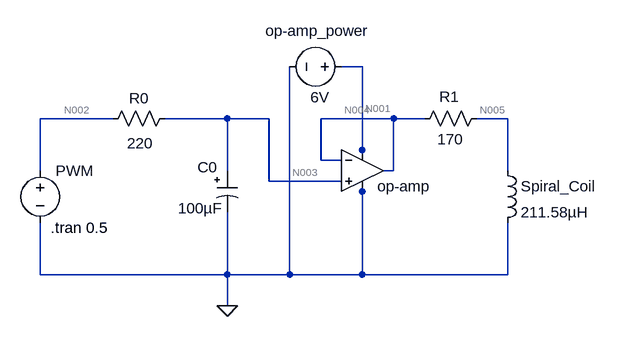
[diagram p0: schematic OpAmp.asc]
OpAmp.asc, the LTspice schematic file:
Version 4
SHEET 1 948 680
WIRE 128 -864 96 -864
WIRE -256 -784 -368 -784
WIRE -80 -784 -176 -784
WIRE -16 -784 -80 -784
WIRE 176 -784 64 -784
WIRE 224 -784 176 -784
WIRE 352 -784 304 -784
WIRE 128 -736 128 -864
WIRE 64 -720 64 -784
WIRE 96 -720 64 -720
WIRE 128 -720 128 -736
WIRE -368 -704 -368 -784
WIRE -80 -704 -80 -784
WIRE 176 -704 176 -784
WIRE 176 -704 160 -704
WIRE 352 -704 352 -784
WIRE -16 -688 -16 -784
WIRE 96 -688 -16 -688
WIRE 128 -672 128 -688
WIRE -368 -544 -368 -624
WIRE -80 -544 -80 -640
WIRE -80 -544 -368 -544
WIRE 16 -544 16 -864
WIRE 16 -544 -80 -544
WIRE 128 -544 128 -672
WIRE 128 -544 16 -544
WIRE 352 -544 352 -624
WIRE 352 -544 128 -544
WIRE -80 -496 -80 -544
FLAG -80 -496 0
SYMBOL voltage -368 -720 R0
WINDOW 3 24 96 Invisible 2
WINDOW 123 0 0 Left 0
WINDOW 39 0 0 Left 0
SYMATTR Value PULSE(0 5 0 0 0 0.0006 0.00066 1000)
SYMATTR InstName PWM
SYMBOL res -160 -800 R90
WINDOW 0 0 56 VBottom 2
WINDOW 3 38 54 VTop 2
SYMATTR InstName R0
SYMATTR Value 220
SYMBOL polcap -96 -704 R0
WINDOW 0 -30 -5 Left 2
WINDOW 3 -60 58 Left 2
SYMATTR InstName C0
SYMATTR Value 100µF
SYMATTR SpiceLine V=10 Irms=1.9 Rser=0.04 Lser=0 mfg="SANYO" pn="10TPC100M" type="Tantalum"
SYMATTR Description Capacitor
SYMATTR Type cap
SYMBOL ind 336 -720 R0
SYMATTR InstName Spiral_Coil
SYMATTR Value 211.58µH
SYMATTR SpiceLine Rser=14.14
SYMBOL OpAmps\\UniversalOpAmp 128 -704 R0
WINDOW 0 23 24 Left 2
SYMATTR InstName op-amp
SYMBOL voltage 112 -864 R90
WINDOW 123 0 0 Left 0
WINDOW 39 0 0 Left 0
WINDOW 0 -55 -29 VRight 2
WINDOW 3 47 35 VRight 2
SYMATTR InstName op-amp_power
SYMATTR Value 6V
SYMBOL res 320 -800 R90
WINDOW 0 -2 58 VBottom 2
WINDOW 3 32 56 VTop 2
SYMATTR InstName R1
SYMATTR Value 170
TEXT -352 -616 Left 2 !.tran 0.5

The netlist it stands for:
* OpAmp.asc
V§PWM N002 0 PULSE(0 5 0 0 0 0.0006 0.00066 1000)
R0 N003 N002 220
C0 N003 0 100µF V=10 Irms=1.9 Rser=0.04 Lser=0 mfg="SANYO" pn="10TPC100M" type="Tantalum"
L§Spiral_Coil N005 0 211.58µH Rser=14.14
Xop-amp N003 N004 N001 0 N004 level1 Avol=1Meg GBW=10Meg Vos=0 En=0 Enk=0 In=0 Ink=0 Rin=500Meg  ; pins In+ In- V+ V- OUT
V§op-amp_power N001 0 6V
R1 N005 N004 170
.tran 0.5
.lib UniversalOpAmp1.lib
.backanno
.end

* Results of the author's LTspice run, read from the files saved beside the schematic
* Operating Point, zero values left out:
*   V(n003) = 1.32 µV
*   V(n005) = 101.4 nV
*   V(n004) = 1.32 µV
*   V(n001) = 6 V
*   I(Spiral_coil) = 7.168 nA
*   I(R0) = 6 nA
*   I(R1) = -7.168 nA
*   I(Pwm) = 6 nA
*   I(Op-amp_power) = -12 nA
*   Ix(op-amp:1) = -6 nA
*   Ix(op-amp:2) = -6 nA
*   Ix(op-amp:3) = 12 nA
*   Ix(op-amp:5) = -2.448 nA
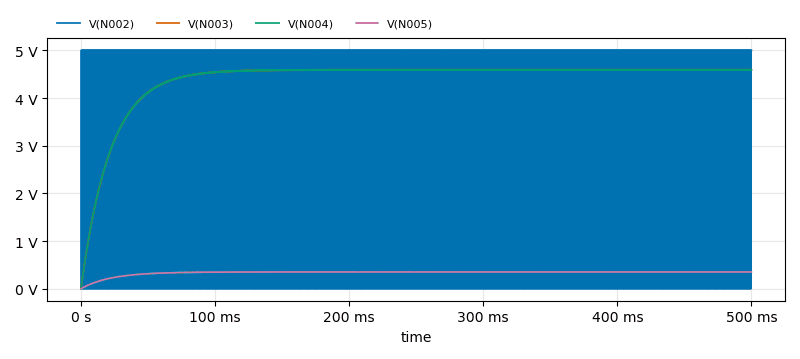
[diagram p1: Transient Analysis of OpAmp.asc, plotted from the saved traces]
* Transient Analysis, 1 run:
*   V(N002): min 0 V, max 5 V, average 4.591 V, rms 4.791 V, last 5 V
*   V(N003): min 1.32 µV, max 4.597 V, average 4.389 V, rms 4.437 V, last 4.592 V
*   V(N004): min 1.32 µV, max 4.596 V, average 4.389 V, rms 4.437 V, last 4.592 V
*   V(N005): min 101.4 nV, max 353 mV, average 337.1 mV, rms 340.8 mV, last 352.7 mV